# Altium schematic sheet USBFX2LP_4.SchDoc: USBFX-4
size A; Revision: 04
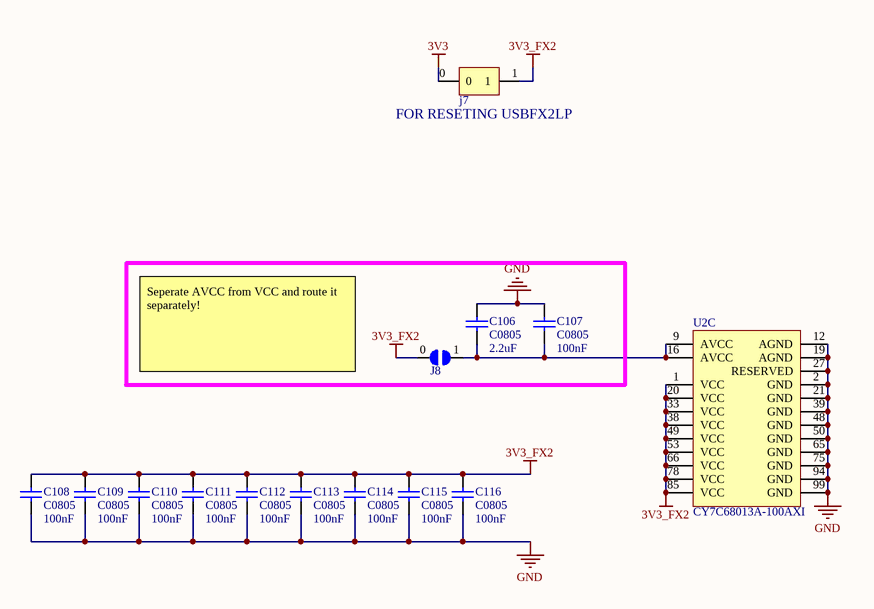
[diagram p0: USBFX2LP_4.SchDoc]

## Parts
C106  C0805  value 2.2uF  [0805]
C107  C0805  value 100nF  [0805]
C108  C0805  value 100nF  [0805]
C109  C0805  value 100nF  [0805]
C110  C0805  value 100nF  [0805]
C111  C0805  value 100nF  [0805]
C112  C0805  value 100nF  [0805]
C113  C0805  value 100nF  [0805]
C114  C0805  value 100nF  [0805]
C115  C0805  value 100nF  [0805]
C116  C0805  value 100nF  [0805]
j7  2pin  [2PIN]  (value not drawn)
J8  jumper  [jumper_pcb]  (value not drawn)
U2  CY7C68013A-100AXI  [CYP-AX100RA_N]  (part C of 3)

## Nets
3V3: j7.0
3V3_FX2: C108.2 C109.2 C110.2 C111.2 C112.2 C113.2 C114.2 C115.2 C116.2 j7.1 J8.0 U2.1(VCC) U2.20(VCC) U2.33(VCC) U2.38(VCC) U2.49(VCC) U2.53(VCC) U2.66(VCC) U2.78(VCC) U2.85(VCC)
GND: C106.2 C107.2 C108.1 C109.1 C110.1 C111.1 C112.1 C113.1 C114.1 C115.1 C116.1 U2.2(GND) U2.12(AGND) U2.19(AGND) U2.21(GND) U2.27(RESERVED) U2.39(GND) U2.48(GND) U2.50(GND) U2.65(GND) U2.75(GND) U2.94(GND) U2.99(GND)
NetC106_1: C106.1 C107.1 J8.1 U2.9(AVCC) U2.16(AVCC)

## Notes on the sheet
- (near j7) FOR RESETING USBFX2LP
- Seperate AVCC from VCC and route it separately!
- Engineer:
- Title:
- Saleh Jamali
- Revision:

## Library data of the parts
C106-C116 = C0805: Ceramic Chip Capacitor - Standard; Note: Footprint corresponds to dimensions for bulk cassette packaging. This case size has tightened tolerances.; Published: 17-Jul-2002; LatestRevisionDate: 19-Mar-2004; LatestRevisionNote: Silkscreen size reduced.; DatasheetDocument: Mar-2001; PackageDocument: Mar-2001; PackageReference: 0805; Publisher: Altium Limited; Code_JEITA: 0805; Code_IPC: 2012[0805]; ComponentLink1Description: Manufacturer Link; ComponentLink1URL: http://www.kemet.com/; ComponentLink2Description: Datasheet; ComponentLink2URL: http://www.kemet.com/kemet/web/homepage/kechome.nsf/vapubfilesname/F3102TA.pdf/$file/F3102TA.pdf
U2 = CY7C68013A-100AXI: EZ-USB(R) FX2LP(TM) USB Microcontroller High-Speed USB Peripheral Controller, 16 KB, 40 I/Os, 3 to 3.6 V, -40 to 85 degC, 100-Pin TQFP (AX100RA), Tray; Manufacturer: Cypress; Max. Operating Voltage (V): 3.6; Memory Architecture: RAM; Memory Size (KB): 16; Min. Operating Voltage (V): 3; No. of I/Os: 40; DatasheetVersion: Rev. *W; PackageVersion: Rev. *E; PackageReference: AX100RA; PackageDescription: 100-Pin Thin Quad Flat Pack, Body 14 x 20 mm, Pitch 0.65 mm; Supplier 1: Digi-Key; Supplier Part Number 1: 428-2263-ND; Supplier 2: Farnell; Supplier Part Number 2: 1876347; Supplier 3: Newark; Supplier Part Number 3: 19M7107; Supplier 4: Mouser; Supplier Part Number 4: 727-CYC68013A100AXI; CPU Core: Enhanced 8051; Max. Operating Temp. (degreesC): 85; Min. Operating Temp. (degreesC): -40; Packing: Tray; RoHS: Pb-Free; Mounting Technology: Surface Mount; Code_JEDEC: MS-026; PartNumber: CY7C68013A-100AXI; ComponentLink1Description: Manufacturer URL; ComponentLink1URL: http://www.cypress.com/; ComponentLink2Description: Datasheet; ComponentLink2URL: http://www.cypress.com/?docID=45142; ComponentLink3Description: Package Specification; ComponentLink3URL: http://www.cypress.com/?docID=48215